# EAGLE design Dashboard HV (EAGLE 5.11)
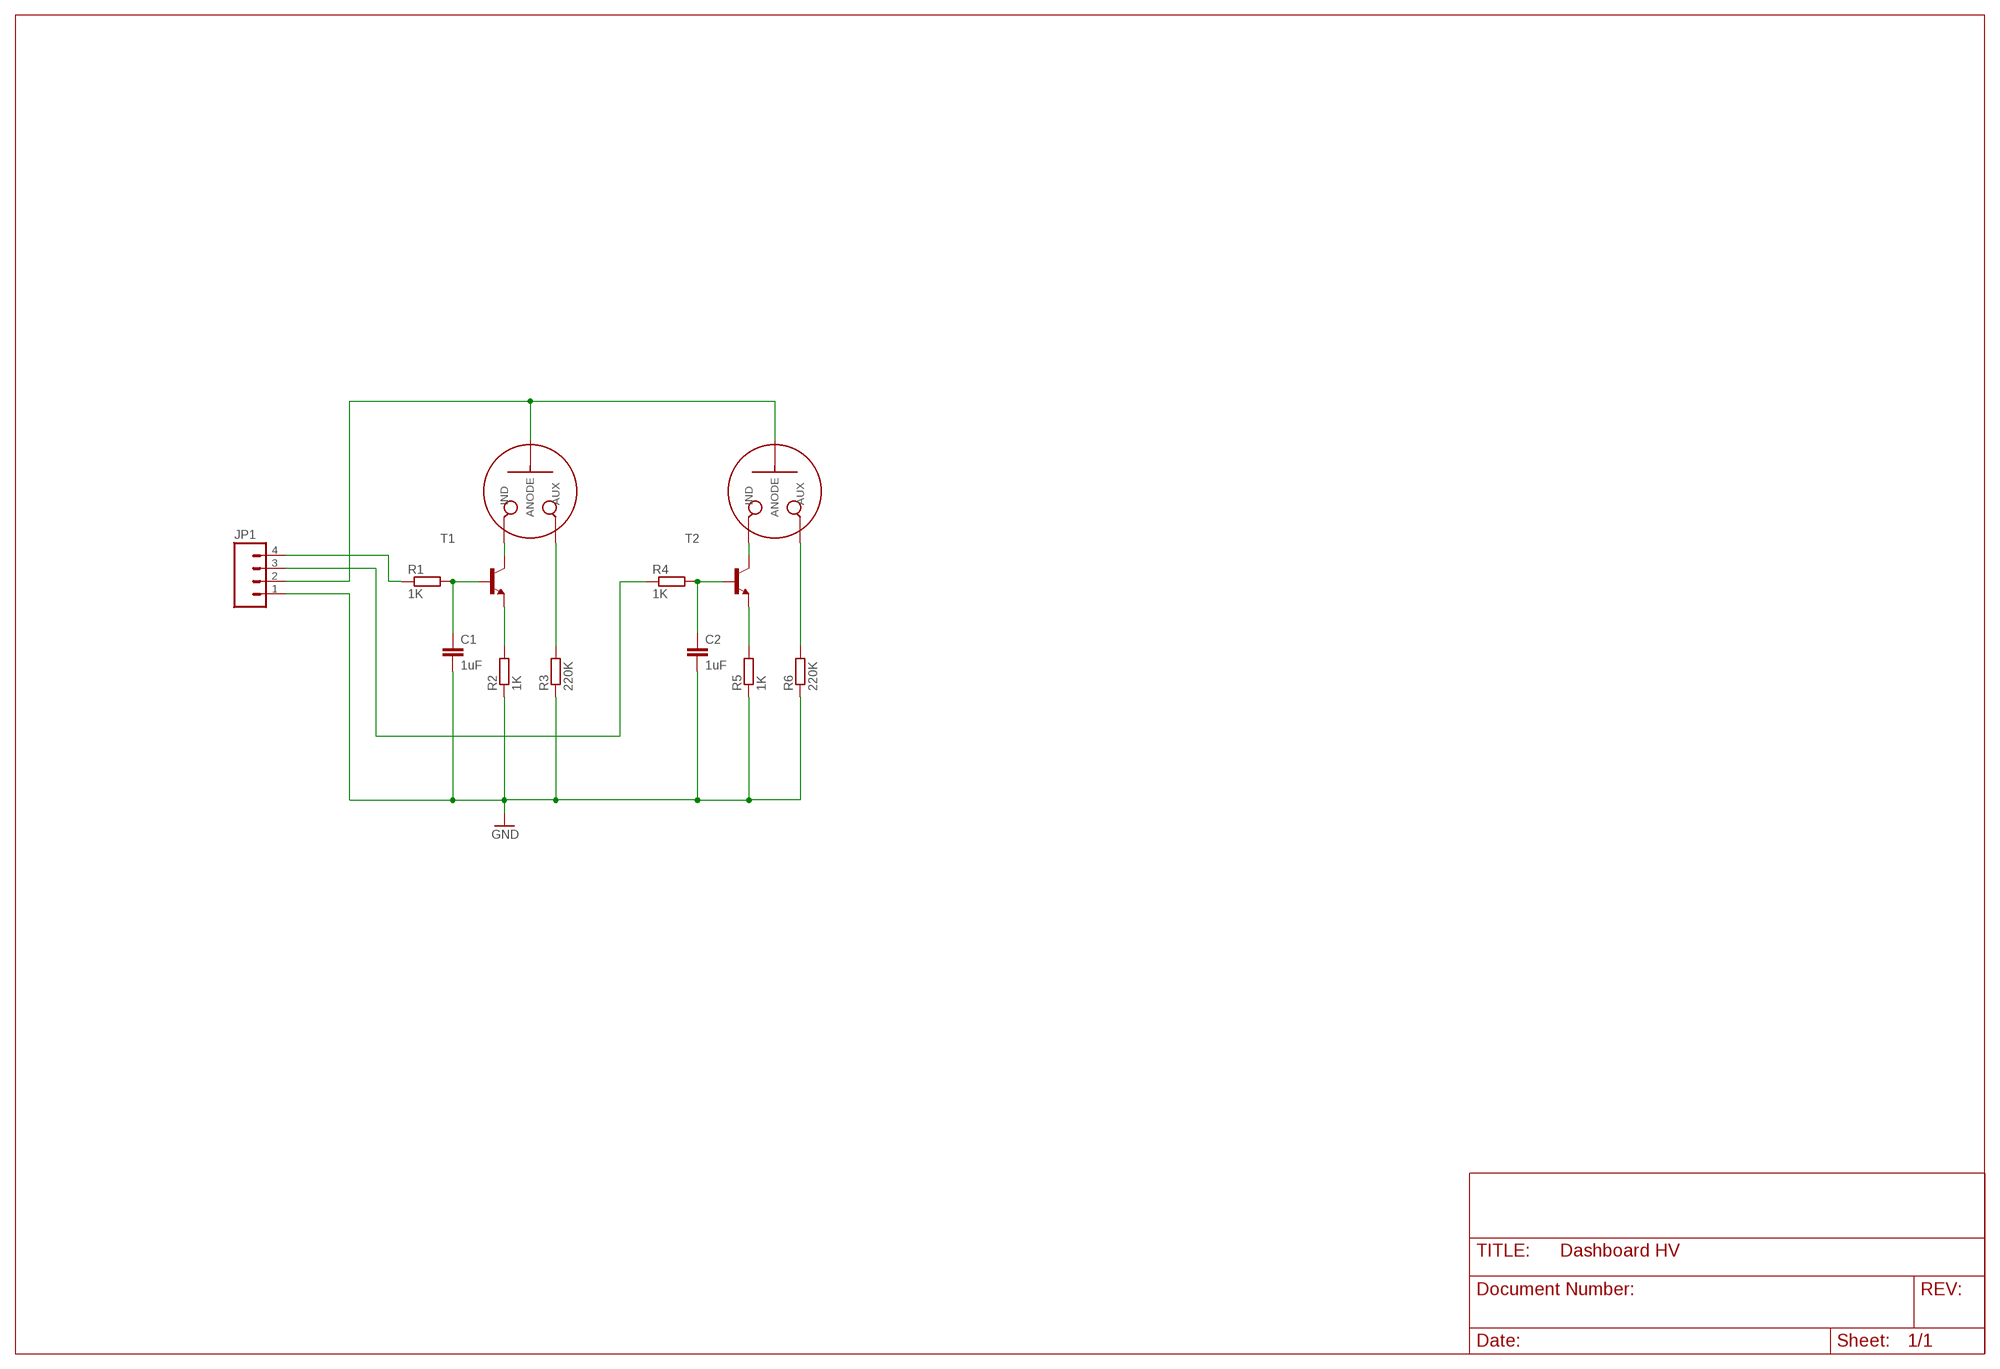
[diagram p0: schematic, sheet 1]

## Parts
C1  1uF  C-EUC0805  [C0805]
C2  1uF  C-EUC0805  [C0805]
JP1  M04POLAR  [MOLEX-1X4]
R1  1K  R-EU_R0805  [R0805]
R2  1K  R-EU_R0805  [R0805]
R3  220K  R-EU_R0805  [R0805]
R4  1K  R-EU_R0805  [R0805]
R5  1K  R-EU_R0805  [R0805]
R6  220K  R-EU_R0805  [R0805]
T1  MMBTA42LT1-NPN-SOT23-BEC  [SOT23-BEC]
T2  MMBTA42LT1-NPN-SOT23-BEC  [SOT23-BEC]
U$1  IN-13  [IN-13]
U$2  IN-13  [IN-13]

## Nets
GND: C1.2 C2.2 JP1.1 R2.1 R3.1 R5.1 R6.1
N$1: R3.2 U$1.AUX
N$2: T1.C U$1.IND
N$3: R2.2 T1.E
N$4: C1.1 R1.2 T1.B
N$5: R6.2 U$2.AUX
N$6: JP1.2 U$1.ANODE U$2.ANODE
N$7: T2.C U$2.IND
N$8: C2.1 R4.2 T2.B
N$9: R5.2 T2.E
N$10: JP1.3 R4.1
N$11: JP1.4 R1.1

## Library data of the parts
C1 C2 = resistor:C-EU: CAPACITOR, European symbol
JP1 = SparkFun:M04: Header 4 Standard 4-pin 0.1" header. Use with straight break away headers (SKU : PRT-00116), right angle break away headers (PRT-00553), swiss pins (PRT-00743), machine pins (PRT-00117), and female headers (PRT-00115). Molex polarized connector foot print use with SKU : PRT-08231 with associated crimp pins and housings. 1MM SMD Version SKU: PRT-10208
R1-R6 = resistor:R-EU_: RESISTOR, European symbol
T1 T2 = transistor:*-NPN-: NPN Transistror BF959 corrected 2008.03.06
U$1 U$2 = DashboardParts:IN-13

## Board
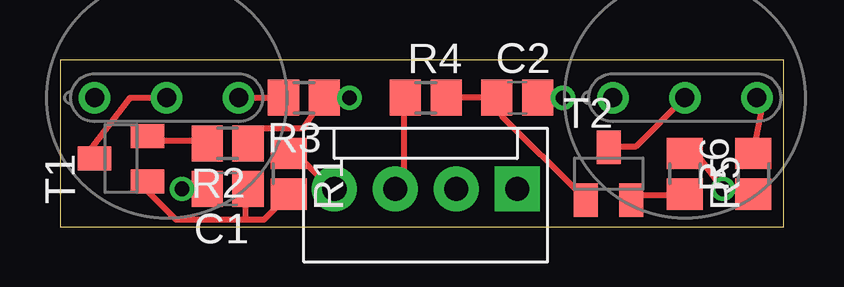
[diagram p1: board, top side]
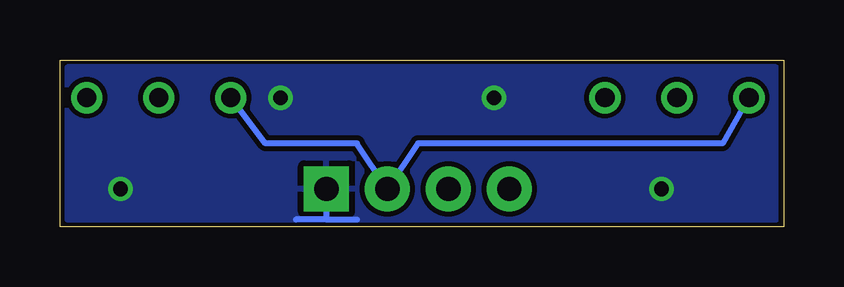
[diagram p2: board, bottom side, seen from below]

Size 30.15 x 6.97 mm. Coordinates in mm from the lower left corner, seen from the top.
Outline: 0,0 30.15,0 30.15,6.97 0,6.97 0,0
Copper layers (1*16): Top 0.035mm / dielectric 1.5mm / Bottom 0.035mm
Design rules "default *": minimum track width 10mil, minimum drill 24mil, track to track 8mil, track to pad 8mil, pad to pad 8mil, via to via 8mil, smd to smd 8mil, copper to edge 1mil, drill to drill 8mil, minimum pad ring 10mil, minimum via ring 8mil, stop-mask expansion 4mil, vias tented up to drill 0mil, thermal gap 10mil

### Footprints (pad centres in the part's own frame; a part is rotated, then mirrored left to right if it is on the bottom)
C0805 = smd 1.3 x 1.5: 1 -0.85,0; 2 0.85,0
MOLEX-1X4 = drill 1.016 pad 1.88 square: 1 0,0 | drill 1.016 pad 1.88 round: 2 2.54,0; 3 5.08,0; 4 7.62,0
R0805 = smd 1.3 x 1.5: 1 -0.85,0; 2 0.85,0
SOT23-BEC = smd 1 x 1.4: B -0.95,-1.1; C 0,1.1; E 0.95,-1.1
IN-13 = drill 0.8 round: ANODE 3,0; AUX -3,0; IND 0,0

### Placement (x,y rotation side)
C1  6.99,1.59 180 top
C2  19.05,5.4 0 top
JP1  19.05,1.59 180 top
R1  9.53,2.22 270 top
R2  6.99,3.49 180 top
R3  10.16,5.4 180 top
R4  15.24,5.4 0 top
R5  26.04,2.22 270 top
R6  28.89,2.22 90 top
T1  2.54,2.86 90 top
T2  22.86,2.22 0 top
U$1  4.45,5.4 180 top
U$2  26.04,5.4 180 top

### Tracks (layer width: path | path; a pad name or v marks a point on that pad's centre or on a via)
GND  (via drill 0.61)
  Top 0.254: R6.1 v27.62,1.59 26.67,2.86 R5.1 | v12.06,5.4 R3.1 10.16,4.13 8.26,4.13 R2.1 | v5.08,1.59 C1.2 6.35,1.59 | C2.2 v20.95,5.4
  Bottom 0.254: 19.05,0.32 17.78,0.32 | 19.05,0.32 20.32,0.32 | JP1.1 19.05,0.32
  pour Bottom: 0.32,6.67 29.84,6.67 29.84,0.32 0.32,0.32
N$1
  Top 0.254: U$1.AUX R3.2
N$2
  Top 0.254: U$1.IND 2.92,5.4 0.89,2.73 0.89,2.86 T1.C
N$3
  Top 0.254: T1.E 3.17,3.62 5.97,3.62 R2.2
N$4
  Top 0.254: 7.75,0.32 8.51,0.32 9.53,1.33 R1.2 | 7.75,0.32 4.83,0.32 3.3,1.84 3.17,1.84 T1.B | 7.75,0.32 7.75,1.59 C1.1
N$5
  Top 0.254: U$2.AUX 29.21,4.76 R6.2
N$6
  Bottom 0.254: U$1.ANODE 2.54,3.49 15.24,3.49 JP1.2 17.78,3.49 21.59,3.49 U$2.ANODE
N$7
  Top 0.254: U$2.IND 24,3.37 22.99,3.37 T2.C
N$8
  Top 0.254: T2.B 21.72,1.33 18.41,4.64 18.41,5.4 C2.1 R4.2
N$9
  Top 0.254: T2.E 24,1.33 26.04,1.33 R5.2
N$10
  Top 0.254: R4.1 14.35,5.4 14.35,1.84 14.1,1.59 JP1.3
N$11
  Top 0.254: R1.1 9.53,2.86 10.03,2.86 11.3,1.59 JP1.4